# EAGLE design Simon_Says_Jump_MAIN (EAGLE 6.5.0)
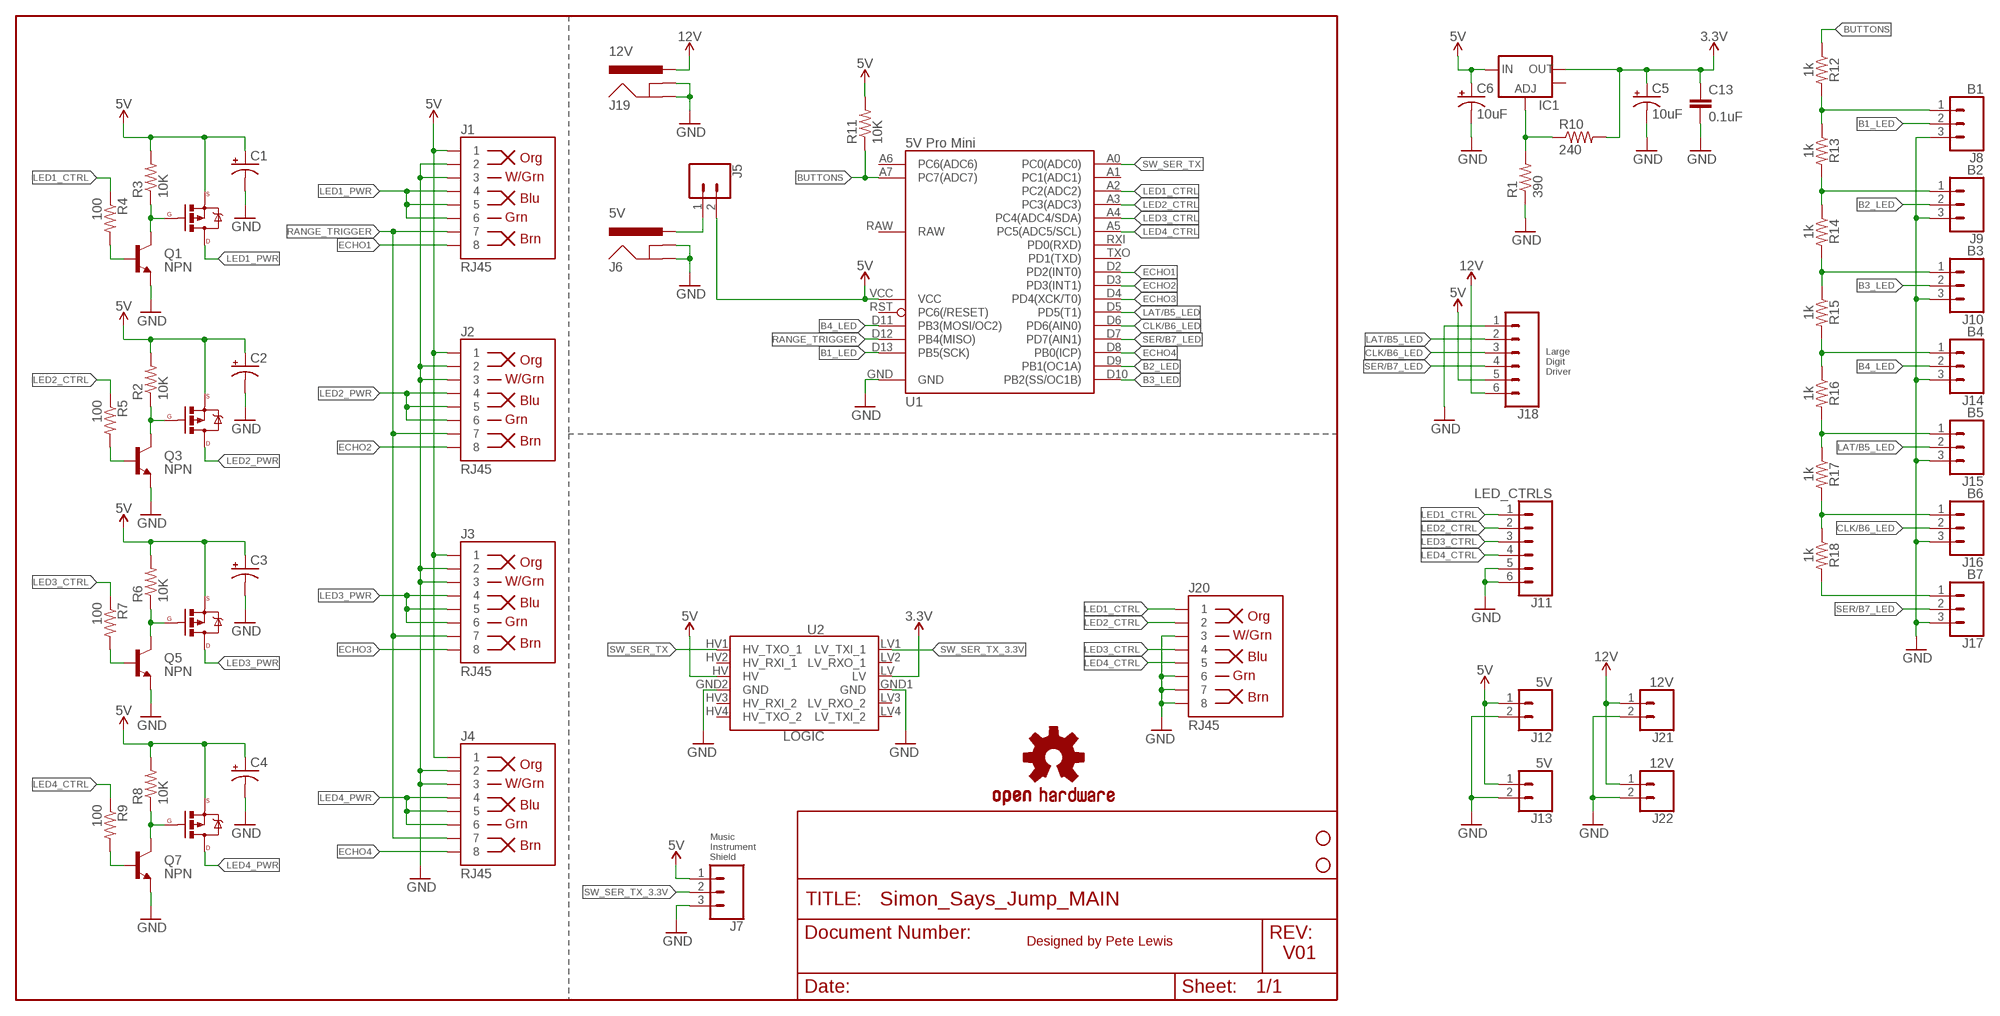
[diagram p0: schematic, sheet 1]

## Parts
C1  CAP_POLCPOL-RADIAL-10UF-25V-KIT  [CPOL-RADIAL-10UF-25V-KIT]
C2  CAP_POLCPOL-RADIAL-10UF-25V-KIT  [CPOL-RADIAL-10UF-25V-KIT]
C3  CAP_POLCPOL-RADIAL-10UF-25V-KIT  [CPOL-RADIAL-10UF-25V-KIT]
C4  CAP_POLCPOL-RADIAL-10UF-25V-KIT  [CPOL-RADIAL-10UF-25V-KIT]
C5  10uF  CAP_POL1206  [EIA3216]
C6  10uF  CAP_POL1206  [EIA3216]
C13  0.1uF  CAP0603-CAP  [0603-CAP]
IC1  V_REG_LM1117SOT223  [SOT223]
J1  RJ45  RJ45-8  [RJ45-8]
J2  RJ45  RJ45-8  [RJ45-8]
J3  RJ45  RJ45-8  [RJ45-8]
J4  RJ45  RJ45-8  [RJ45-8]
J5  CONN_02PTH3  [1X02_LONGPADS]
J6  5V  POWER_JACKPTH_LOCK  [POWER_JACK_PTH_LOCK]
J7  CONN_03LONGPADS  [1X03_LONGPADS]
J8  B1  CONN_03LONGPADS  [1X03_LONGPADS]
J9  B2  CONN_03LONGPADS  [1X03_LONGPADS]
J10  B3  CONN_03LONGPADS  [1X03_LONGPADS]
J11  LED_CTRLS  CONN_06LONGPADS  [1X06_LONGPADS]
J12  5V  CONN_02PTH3  [1X02_LONGPADS]
J13  5V  CONN_02PTH3  [1X02_LONGPADS]
J14  B4  CONN_03LONGPADS  [1X03_LONGPADS]
J15  B5  CONN_03LONGPADS  [1X03_LONGPADS]
J16  B6  CONN_03LONGPADS  [1X03_LONGPADS]
J17  B7  CONN_03LONGPADS  [1X03_LONGPADS]
J18  CONN_06LONGPADS  [1X06_LONGPADS]
J19  12V  POWER_JACKPTH_LOCK  [POWER_JACK_PTH_LOCK]
J20  RJ45  RJ45-8  [RJ45-8]
J21  12V  CONN_02PTH3  [1X02_LONGPADS]
J22  12V  CONN_02PTH3  [1X02_LONGPADS]
JP1  STAND-OFFTIGHTER  [STAND-OFF-TIGHTER]
JP7  STAND-OFFTIGHTER  [STAND-OFF-TIGHTER]
LOGO1  OSHW-LOGOL  [OSHW-LOGO-L]
Q1  NPN  TRANSISTOR_NPNSOT23  [SOT23]
Q2  P-Channel MOSFET  MOSFET-PCHANNELPTH  [TO220V]
Q3  NPN  TRANSISTOR_NPNSOT23  [SOT23]
Q4  P-Channel MOSFET  MOSFET-PCHANNELPTH  [TO220V]
Q5  NPN  TRANSISTOR_NPNSOT23  [SOT23]
Q6  P-Channel MOSFET  MOSFET-PCHANNELPTH  [TO220V]
Q7  NPN  TRANSISTOR_NPNSOT23  [SOT23]
Q8  P-Channel MOSFET  MOSFET-PCHANNELPTH  [TO220V]
R1  390  RESISTOR0603-RES  [0603-RES]
R2  10K  RESISTOR0603-RES  [0603-RES]
R3  10K  RESISTOR0603-RES  [0603-RES]
R4  100  RESISTOR0603-RES  [0603-RES]
R5  100  RESISTOR0603-RES  [0603-RES]
R6  10K  RESISTOR0603-RES  [0603-RES]
R7  100  RESISTOR0603-RES  [0603-RES]
R8  10K  RESISTOR0603-RES  [0603-RES]
R9  100  RESISTOR0603-RES  [0603-RES]
R10  240  RESISTOR0603-RES  [0603-RES]
R11  10K  RESISTOR0603-RES  [0603-RES]
R12  1k  1KOHM-0603-1/10W-1%  [0603]
R13  1k  1KOHM-0603-1/10W-1%  [0603]
R14  1k  1KOHM-0603-1/10W-1%  [0603]
R15  1k  1KOHM-0603-1/10W-1%  [0603]
R16  1k  1KOHM-0603-1/10W-1%  [0603]
R17  1k  1KOHM-0603-1/10W-1%  [0603]
R18  1k  1KOHM-0603-1/10W-1%  [0603]
U1  5V Pro Mini  ARDUINO_PRO_MINI-V13-DIP  [ARDUINO_PRO_MINI-V13_DIP]
U2  LOGIC  SPARKFUN_LOGIC_LEVEL_CONVERTER  [SPARKFUN_LOGIC_LEVEL_CONVERTER]

## Nets
3.3V: C5.A(+) C13.1 IC1.2(OUT) R10.2 U2.LV
5V: C1.1(+) C2.1(+) C3.1(+) C4.1(+) C6.A(+) IC1.3(IN) J1.1 J2.1 J3.1 J4.1 J5.2 J7.1 J12.1 J13.1 J18.5 Q2.3(S) Q4.3(S) Q6.3(S) Q8.3(S) R2.2 R3.2 R6.2 R8.2 R11.2 U1.VCC U2.HV
12V: J18.6 J19.PWR J21.1 J22.1
B1_LED: J8.2 U1.D13(PB5(SCK))
B2_LED: J9.2 U1.D9(PB1(OC1A))
B3_LED: J10.2 U1.D10(PB2(SS/OC1B))
B4_LED: J14.2 U1.D11(PB3(MOSI/OC2))
BUTTONS: R11.1 R12.1 U1.A7(PC7(ADC7))
CLK/B6_LED: J16.2 J18.3 U1.D6(PD6(AIN0))
ECHO1: J1.8 U1.D2(PD2(INT0))
ECHO2: J2.8 U1.D3(PD3(INT1))
ECHO3: J3.8 U1.D4(PD4(XCK/T0))
ECHO4: J4.8 U1.D8(PB0(ICP))
GND: C1.2(-) C2.2(-) C3.2(-) C4.2(-) C5.C(-) C6.C(-) C13.2 J1.2 J1.3 J2.2 J2.3 J3.2 J3.3 J4.2 J4.3 J6.GND J6.GNDBREAK J7.3 J8.3 J9.3 J10.3 J11.5 J11.6 J12.2 J13.2 J14.3 J15.3 J16.3 J17.3 J18.1 J19.GND J19.GNDBREAK J20.3 J20.6 J20.7 J20.8 J21.2 J22.2 Q1.2(E) Q3.2(E) Q5.2(E) Q7.2(E) R1.1 U1.GND U2.GND1(GND) U2.GND2(GND)
LAT/B5_LED: J15.2 J18.2 U1.D5(PD5(T1))
LED1_CTRL [10_mil]: J11.1 J20.1 R4.1 U1.A2(PC2(ADC2))
LED1_PWR [12_mil]: J1.4 J1.5 J1.6 Q2.2(D)
LED2_CTRL [10_mil]: J11.2 J20.2 R5.1 U1.A3(PC3(ADC3))
LED2_PWR: J2.4 J2.5 J2.6 Q4.2(D)
LED3_CTRL [10_mil]: J11.3 J20.4 R7.1 U1.A4(PC4(ADC4/SDA))
LED3_PWR: J3.4 J3.5 J3.6 Q6.2(D)
LED4_CTRL [10_mil]: J11.4 J20.5 R9.1 U1.A5(PC5(ADC5/SCL))
LED4_PWR: J4.4 J4.5 J4.6 Q8.2(D)
N$1 [10_mil]: Q3.3(C) Q4.1(G) R2.1
N$2: J8.1 R12.2 R13.1
N$3: Q1.1(B) R4.2
N$4: J5.1 J6.PWR
N$5 [10_mil]: Q1.3(C) Q2.1(G) R3.1
N$6: J9.1 R13.2 R14.1
N$7: Q3.1(B) R5.2
N$8 [10_mil]: Q5.3(C) Q6.1(G) R6.1
N$9: Q5.1(B) R7.2
N$10 [10_mil]: Q7.3(C) Q8.1(G) R8.1
N$11 [10_mil]: IC1.1(ADJ) R1.2 R10.1
N$12: Q7.1(B) R9.2
N$13: J10.1 R14.2 R15.1
N$14: J14.1 R15.2 R16.1
N$15: J15.1 R16.2 R17.1
N$16: J16.1 R17.2 R18.1
N$17: J17.1 R18.2
RANGE_TRIGGER: J1.7 J2.7 J3.7 J4.7 U1.D12(PB4(MISO))
SER/B7_LED: J17.2 J18.4 U1.D7(PD7(AIN1))
SW_SER_TX: U1.A0(PC0(ADC0)) U2.HV1(HV_TXO_1)
SW_SER_TX_3.3V: J7.2 U2.LV1(LV_TXI_1)
Unconnected: IC1.4(OUT) U1.A1(PC1(ADC1)) U1.A6(PC6(ADC6)) U1.RAW U1.RST(PC6(/RESET)) U1.RXI(PD0(RXD)) U1.TXO(PD1(TXD)) U2.HV2(HV_RXI_1) U2.HV3(HV_RXI_2) U2.HV4(HV_TXO_2) U2.LV2(LV_RXO_1) U2.LV3(LV_RXO_2) U2.LV4(LV_TXI_2)

## Notes on the sheet
- S
- G
- D
- Large
  Digit
  Driver
- S
- G
- D
- S
- G
- D
- S
- G
- D
- Music 
  Instrument 
  Shield
- Designed by Pete Lewis
- V01

## Library data of the parts
C1-C4 = Testing:CAP_POL: Capacitor Polarized These are standard SMD and PTH capacitors. Normally 10uF, 47uF, and 100uF in electrolytic and tantalum varieties. Always verify the external diameter of the through hole cap, it varies with capacity, voltage, and manufacturer. The EIA devices should be standard.
C5 C6 = SparkFun:CAP_POL: Capacitor Polarized These are standard SMD and PTH capacitors. Normally 10uF, 47uF, and 100uF in electrolytic and tantalum varieties. Always verify the external diameter of the through hole cap, it varies with capacity, voltage, and manufacturer. The EIA devices should be standard.
C13 = SparkFun:CAP: Capacitor Standard 0603 ceramic capacitor, and 0.1" leaded capacitor.
IC1 = SparkFun:V_REG_LM1117: Voltage Regulator LM1117 Standard adjustable voltage regulator but in SMD form. Spark Fun Electronics SKU : COM-00595
J1-J4 J20 = SparkFun-Connectors:RJ45-8: RJ45 Jack - 8 pin Simple RJ45, 8-pin connection. Commonly used for Cat5, Cat5e, and Cat6 Ethernet cables. Here is the connector we sell at SparkFun: RJ45 8-Pin Connector <https://www.sparkfun.com/products/643> (PRT-00643) Datasheet <https://cdn.sparkfun.com/datasheets/Prototyping/04908.pdf> It is used on this SparkFun product: SparkFun RJ45 Breakout <https://www.sparkfun.com/products/716> (BOB-00716) Note, you may also be interested in the "MAGJACK" version of this. It is basically a RJ45 connector, but also has some status LEDs built into the connector housing. You can check that out in this library at the device named "MAGJACK.dev" and see these products online: RJ45 Ethernet MagJack-Compatible <https://www.sparkfun.com/products/8534> (PRT-08534) SparkFun RJ45 MagJack Breakout <https://www.sparkfun.com/products/13021> (BOB-13021); PROD_ID: CONN-08506; SF_ID: PRT-00643
J5 J12 J13 J21 J22 = SparkFun-Connectors:CONN_02: Multi connection point. Often used as Generic Header-pin footprint for 0.1 inch spaced/style header connections On any of the 0.1 inch spaced packages, you can populate with these: Break Away Headers - Straight <https://www.sparkfun.com/products/116> (PRT-00116) Break Away Male Headers - Right Angle <https://www.sparkfun.com/products/553> (PRT-00553) Female Headers <https://www.sparkfun.com/products/115> (PRT-00115) Break Away Headers - Machine Pin <https://www.sparkfun.com/products/117> (PRT-00117) Break Away Female Headers - Swiss Machine Pin <https://www.sparkfun.com/products/743> (PRT-00743) For SCREWTERMINALS and SPRING TERMINALS visit here: Screw Terimnals on SparkFun.com <https://www.sparkfun.com/search/results?term=Screw+Terminals> (5mm/3.5mm/2.54mm spacing) This device is also useful as a general connection point to wire up your design to another part of your project. Our various solder wires solder well into these plated through hole pads. Hook-Up Wire - Assortment (Stranded, 22 AWG) <https://www.sparkfun.com/products/11375> (PRT-11375) Hook-Up Wire - Assortment (Solid Core, 22 AWG) <https://www.sparkfun.com/products/11367> (PRT-11367) View the entire wire category on our website here <https://www.sparkfun.com/categories/141> Special notes: Molex polarized connector foot print use with: PRT-08233 with associated crimp pins and housings. 2.54_SCREWTERM for use with PRT-10571. 3.5mm Screw Terminal footprints for PRT-08084 5mm Screw Terminal footprints for use with PRT-08432
J6 J19 = SparkFun:POWER_JACK: Power Jack This is the standard 5.5mm barrel jack for power. The PTH is the most common, proven, reliable, footprint. All others are experimental. The Slot footprint only works if the mill layer is transmitted to the PCB fab house so be warned. Spark Fun Electronics SKU : PRT-00119. Mating wall wart : TOL-00298 (and others)
J7-J10 J14-J17 = SparkFun-Connectors:CONN_03: Multi connection point. Often used as Generic Header-pin footprint for 0.1 inch spaced/style header connections On any of the 0.1 inch spaced packages, you can populate with these: Break Away Headers - Straight <https://www.sparkfun.com/products/116> (PRT-00116) Break Away Male Headers - Right Angle <https://www.sparkfun.com/products/553> (PRT-00553) Female Headers <https://www.sparkfun.com/products/115> (PRT-00115) Break Away Headers - Machine Pin <https://www.sparkfun.com/products/117> (PRT-00117) Break Away Female Headers - Swiss Machine Pin <https://www.sparkfun.com/products/743> (PRT-00743) Stackable Header - 3 Pin (Female, 0.1") <https://www.sparkfun.com/products/13875> (PRT-13875) For SCREWTERMINALS and SPRING TERMINALS visit here: Screw Terimnals on SparkFun.com <https://www.sparkfun.com/search/results?term=Screw+Terminals> (5mm/3.5mm/2.54mm spacing) This device is also useful as a general connection point to wire up your design to another part of your project. Our various solder wires solder well into these plated through hole pads. Hook-Up Wire - Assortment (Stranded, 22 AWG) <https://www.sparkfun.com/products/11375> (PRT-11375) Hook-Up Wire - Assortment (Solid Core, 22 AWG) <https://www.sparkfun.com/products/11367> (PRT-11367) View the entire wire category on our website here <https://www.sparkfun.com/categories/141> Special notes: Molex polarized connector foot print use with SKU : PRT-08232 with associated crimp pins and housings.
J11 J18 = SparkFun-Connectors:CONN_06: Multi connection point. Often used as Generic Header-pin footprint for 0.1 inch spaced/style header connections On any of the 0.1 inch spaced packages, you can populate with these: Break Away Headers - Straight <https://www.sparkfun.com/products/116> (PRT-00116) Break Away Male Headers - Right Angle <https://www.sparkfun.com/products/553> (PRT-00553) Female Headers <https://www.sparkfun.com/products/115> (PRT-00115) Break Away Headers - Machine Pin <https://www.sparkfun.com/products/117> (PRT-00117) Break Away Female Headers - Swiss Machine Pin <https://www.sparkfun.com/products/743> (PRT-00743) Arduino Stackable Header - 6 Pin <https://www.sparkfun.com/products/9280> (PRT-09280) For SCREWTERMINALS and SPRING TERMINALS visit here: Screw Terimnals on SparkFun.com <https://www.sparkfun.com/search/results?term=Screw+Terminals> (5mm/3.5mm/2.54mm spacing) This device is also useful as a general connection point to wire up your design to another part of your project. Our various solder wires solder well into these plated through hole pads. Hook-Up Wire - Assortment (Stranded, 22 AWG) <https://www.sparkfun.com/products/11375> (PRT-11375) Hook-Up Wire - Assortment (Solid Core, 22 AWG) <https://www.sparkfun.com/products/11367> (PRT-11367) View the entire wire category on our website here <https://www.sparkfun.com/categories/141> Special notes: Molex polarized connector foot print use with SKU : PRT-08231 with associated crimp pins and housings. 1MM SMD Version SKU: PRT-10208 NOTES ON THE VARIANTS LOCK and LOCK_LONGPADS... This footprint was designed to help hold the alignment of a through-hole component (i.e. 6-pin header) while soldering it into place. You may notice that each hole has been shifted either up or down by 0.005 of an inch from it's more standard position (which is a perfectly straight line). This slight alteration caused the pins (the squares in the middle) to touch the edges of the holes. Because they are alternating, it causes a "brace" to hold the component in place. 0.005 has proven to be the perfect amount of "off-center" position when using our standard breakaway headers. Although looks a little odd when you look at the bare footprint, once you have a header in there, the alteration is very hard to notice. Also,if you push a header all the way into place, it is covered up entirely on the bottom side.
JP1 JP7 = Testing:STAND-OFF: Stand Off This is the mechanical footprint for a #4 phillips button head screw. Use the keepout ring to avoid running the screw head into surrounding components. SKU : PRT-00447
LOGO1 = SparkFun-Aesthetics:OSHW-LOGO: Open-Source Hardware (OSHW) Logo This logo indicates the piece of hardware it is found on incorporates a OSHW license and/or adheres to the definition of open source hardware found here: http://freedomdefined.org/OSHW
Q1 Q3 Q5 Q7 = SparkFun:TRANSISTOR_NPN: Transistor NPN BJT configuration in SOT23 package. MMBT2222 is the common NPN we use. Double check BCE configuration again layout.
Q2 Q4 Q6 Q8 = Testing:MOSFET-PCHANNEL
R1-R11 = SparkFun:RESISTOR: Resistor Basic schematic elements and footprints for 0603, 1206, and PTH resistors.
R12-R18 = SparkFun-Resistors:1KOHM: 1kΩ resistor A resistor is a passive two-terminal electrical component that implements electrical resistance as a circuit element. Resistors act to reduce current flow, and, at the same time, act to lower voltage levels within circuits. - Wikipedia; PROD_ID: RES-07856
U1 = Testing:ARDUINO_PRO_MINI-V13-DIP
U2 = SparkFun-Boards:SPARKFUN_LOGIC_LEVEL_CONVERTER: SparkFun Logic Level Converter -Bi-Directional This is the mechnical outline for the 3.3V - 5V bi directional logic level converter. SparkFun Products: SparkFun Logic Level Converter - Bi-Directional <https://www.sparkfun.com/products/12009>

## Net classes
1 8_mil: width 0.203 mm
2 10_mil: width 0.254 mm
3 12_mil: width 0.305 mm
4 15_mil: width 0.381 mm
5 20_mil: width 0.508 mm
6 25_mil: width 0.635 mm
7 30_mil: width 0.762 mm

## Board
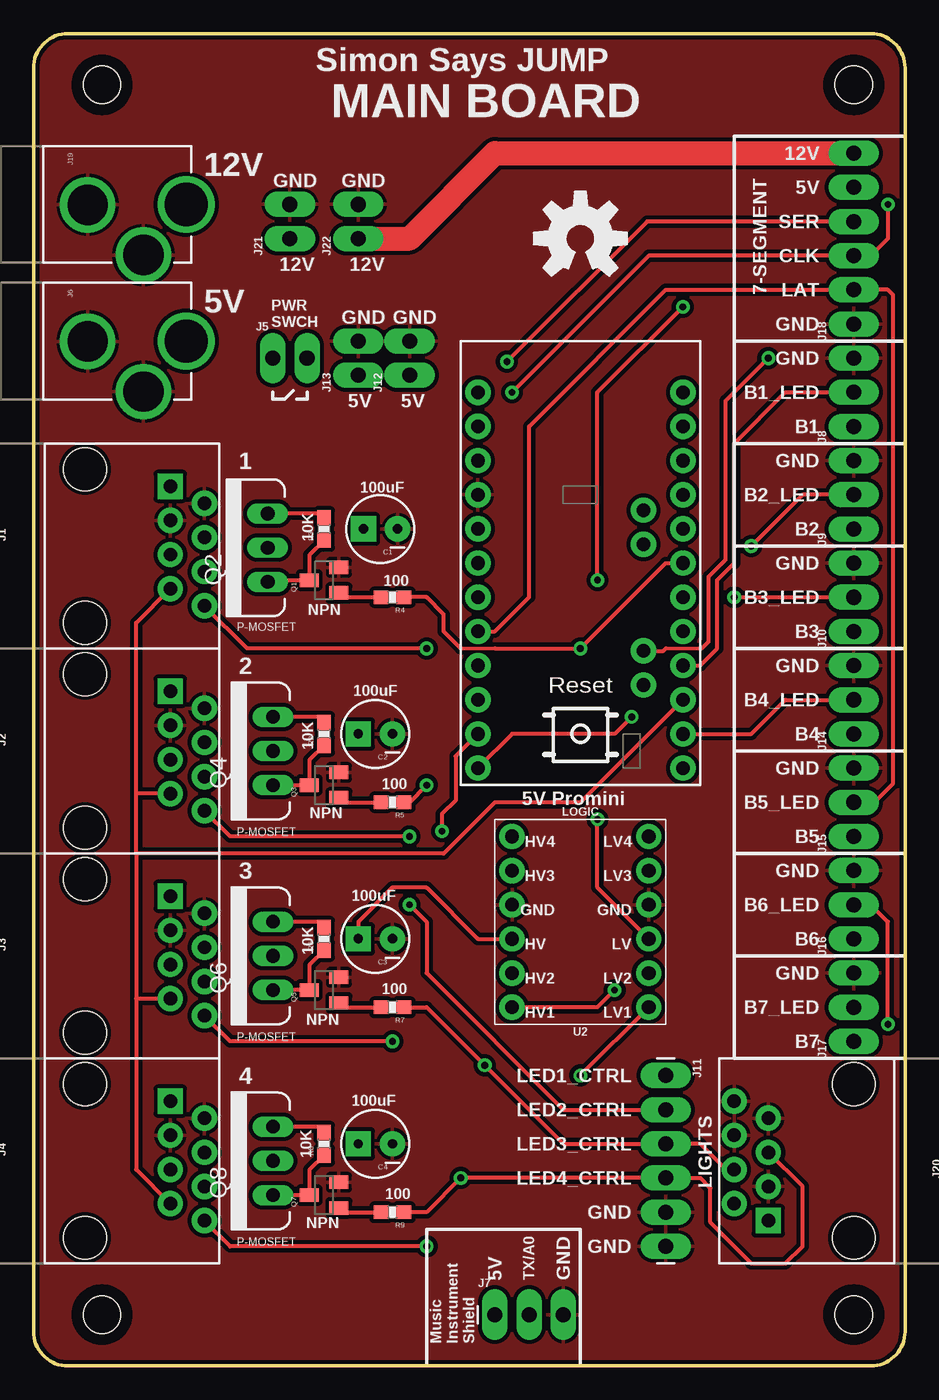
[diagram p1: board, top side]
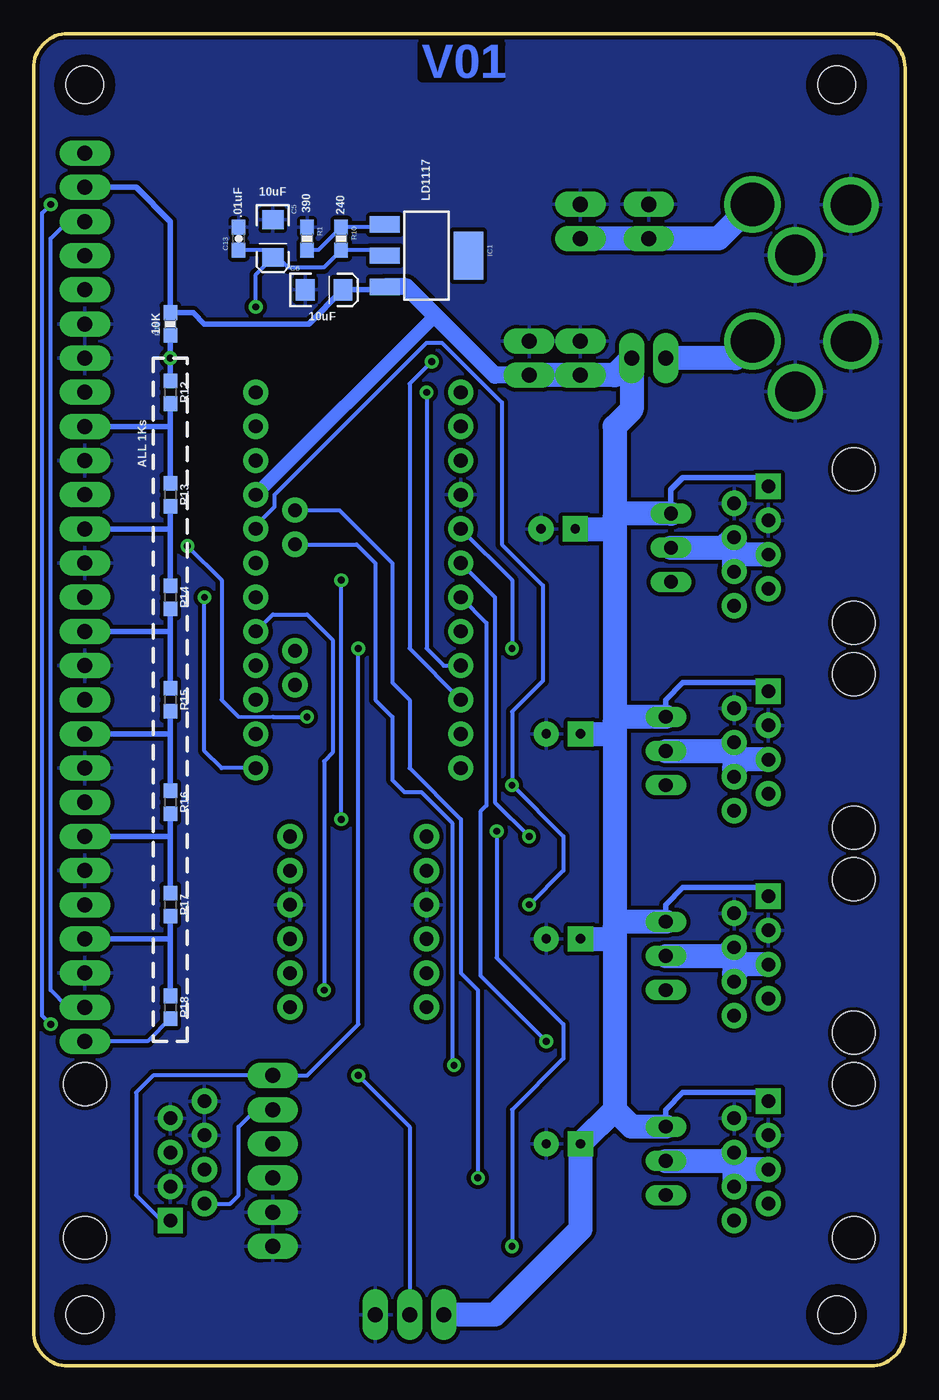
[diagram p2: board, bottom side, seen from below]

Size 64.77 x 99.06 mm. Coordinates in mm from the lower left corner, seen from the top.
Outline: 62.23,0 2.54,0 arc-90 0,2.54 0,96.52 arc-90 2.54,99.06 62.23,99.06 arc-90 64.77,96.52 64.77,2.54 arc-90 62.23,0
Copper layers (1*16): Top 0.035mm / dielectric 1.5mm / Bottom 0.035mm
Design rules "SparkFun-2-layer-STANDARD *": minimum track width 8mil, minimum drill 20mil, track to track 10mil, track to pad 8mil, pad to pad 8mil, via to via 10mil, smd to smd 8mil, copper to edge 8mil, drill to drill 8mil, minimum pad ring 10mil, minimum via ring 10mil, stop-mask expansion 4mil, vias tented up to drill 25mil, thermal gap 10mil

### Footprints (pad centres in the part's own frame; a part is rotated, then mirrored left to right if it is on the bottom)
CPOL-RADIAL-10UF-25V-KIT = drill 0.7 pad 1.88 square: 1 1.27,0 | drill 0.7 pad 1.88: 2 -1.27,0
EIA3216 = smd 1.4 x 1.6: A 1.4,0; C -1.4,0
0603-CAP = smd 1.1 x 1: 1 -0.85,0; 2 0.85,0
SOT223 = smd 1.219 x 2.235: 1 -2.311,-3.099; 2 0,-3.099; 3 2.311,-3.099 | smd 3.6 x 2.2: 4 0,3.099
RJ45-8 = drill 1 pad 1.88 square: 1 -4.445,6.35 | drill 1 pad 1.88: 2 -3.175,8.89; 3 -1.905,6.35; 4 -0.635,8.89; 5 0.635,6.35; 6 1.905,8.89; 7 3.175,6.35; 8 4.445,8.89 | hole 3.2: -5.715,0; 5.715,0
1X02_LONGPADS = drill 1.118 pad 1.88 long: 1 0,0; 2 2.54,0
POWER_JACK_PTH_LOCK = drill 2.997 pad 4.115: GND 0.025,6.557; GNDBREAK 3.762,10.7 | drill 3.2 pad 4.115: PWR 0,13.878
1X03_LONGPADS = drill 1.118 pad 1.88 long: 1 0,0; 2 2.54,0; 3 5.08,0
1X06_LONGPADS = drill 1.118 pad 1.88 long: 1 0,0; 2 2.54,0; 3 5.08,0; 4 7.62,0; 5 10.16,0; 6 12.7,0
STAND-OFF-TIGHTER = hole 2.794: 0,0
SOT23 = smd 1 x 1.4: 1 -0.95,-1.1; 2 0.95,-1.1; 3 0,1.1
TO220V = drill 1.016 long: 1 -2.54,0; 2 0,0; 3 2.54,0
0603-RES = smd 1.1 x 1: 1 -0.85,0; 2 0.85,0
0603 = smd 1.1 x 1: 1 -0.85,0; 2 0.85,0
ARDUINO_PRO_MINI-V13_DIP = drill 1.016 pad 1.88: A0 16.51,11.43; A1 16.51,13.97; A2 16.51,16.51; A3 16.51,19.05; A4 13.589,17.907; A5 13.589,20.447; A6 13.589,7.442; A7 13.589,9.982; D2 1.27,19.05; D3 1.27,16.51; D4 1.27,13.97; D5 1.27,11.43; D6 1.27,8.89; D7 1.27,6.35; D8 1.27,3.81; D9 1.27,1.27; D10 16.51,1.27; D11 16.51,3.81; D12 16.51,6.35; D13 16.51,8.89; GND 1.27,21.59; GND2 16.51,26.67; RAW 16.51,29.21; RST 1.27,24.13; RST2 16.51,24.13; RXI 1.27,26.67; TXO 1.27,29.21; VCC 16.51,21.59
SPARKFUN_LOGIC_LEVEL_CONVERTER = drill 1.016 pad 1.88: GND1 -5.08,-1.27; GND2 5.08,-1.27; HV 5.08,1.27; HV1 5.08,6.35; HV2 5.08,3.81; HV3 5.08,-3.81; HV4 5.08,-6.35; LV -5.08,1.27; LV1 -5.08,6.35; LV2 -5.08,3.81; LV3 -5.08,-3.81; LV4 -5.08,-6.35

### Placement (x,y rotation side)
C1  25.78,62.23 180 top
C2  25.4,46.99 180 top
C3  25.4,31.75 180 top
C4  25.4,16.51 180 top
C5  46.99,83.82 270 bottom
C6  43.18,80.01 0 bottom
C13  49.53,83.82 90 bottom
IC1  35.56,82.55 270 bottom
J1  3.81,60.96 270 top
J2  3.81,45.72 270 top
J3  3.81,30.48 270 top
J4  3.81,15.24 270 top
J5  17.78,74.93 0 top
J6  -2.54,76.2 270 top
J7  34.29,3.81 0 top
J8  60.96,69.85 90 top
J9  60.96,62.23 90 top
J10  60.96,54.61 90 top
J11  46.99,21.59 270 top
J12  27.94,73.66 90 top
J13  24.13,73.66 90 top
J14  60.96,46.99 90 top
J15  60.96,39.37 90 top
J16  60.96,31.75 90 top
J17  60.96,24.13 90 top
J18  60.96,77.47 90 top
J19  -2.54,86.36 270 top
J20  60.96,15.24 90 top
J21  19.05,83.82 90 top
J22  24.13,83.82 90 top
JP1  5.08,95.25 0 top
JP2  STAND-OFFTIGHTER  [STAND-OFF-TIGHTER]  60.96,95.25 0 top
JP3  STAND-OFFTIGHTER  [STAND-OFF-TIGHTER]  60.96,3.81 0 top
JP7  5.08,3.81 0 top
LOGO1  40.64,83.82 0 top
Q1  21.59,58.42 90 top
Q2  17.4,60.83 90 top
Q3  21.59,43.18 90 top
Q4  17.78,45.72 90 top
Q5  21.59,27.94 90 top
Q6  17.78,30.48 90 top
Q7  21.59,12.7 90 top
Q8  17.78,15.24 90 top
R1  44.45,83.82 270 bottom
R2  21.59,46.99 90 top
R3  21.59,62.23 90 top
R4  26.67,57.15 180 top
R5  26.67,41.91 180 top
R6  21.59,31.75 90 top
R7  26.67,26.67 180 top
R8  21.59,16.51 90 top
R9  26.67,11.43 180 top
R10  41.91,83.82 270 bottom
R11  54.61,77.47 90 bottom
R12  54.61,72.39 270 bottom
R13  54.61,64.77 270 bottom
R14  54.61,57.15 270 bottom
R15  54.61,49.53 270 bottom
R16  54.61,41.91 270 bottom
R17  54.61,34.29 270 bottom
R18  54.61,26.67 270 bottom
U1  31.75,43.18 0 top
U2  40.64,33.02 180 top

### Tracks (layer width: path | path; a pad name or v marks a point on that pad's centre or on a via)
3.3V  (via drill 0.51)
  Top 0.305: U2.LV 41.91,35.56 v41.91,40.64 | v41.91,58.42 41.91,72.39 v48.26,78.74
  Bottom 0.305: IC1.2 39.08,82.97 R10.2 43.22,81.66 45.85,81.66 46.61,82.42 C5.A | C5.A 47.54,82.97 C13.1 | v41.91,40.64 v41.91,58.42 | v48.26,78.74 48.26,81.15 C5.A
5V
  Top 0.305: R8.2 21.17,17.78 Q8.3 | R6.2 21.17,33.02 Q6.3 | R2.2 21.17,48.26 Q4.3 | R3.2 21.3,63.37 Q2.3 | U2.HV 33.02,31.75 29.21,35.56 26.67,35.56 24.13,33.02 C3.1
  Bottom 0.406: Q2.3 17.4,65.15 16.51,66.04 10.79,66.04 J1.1 | Q4.3 17.78,49.53 16.51,50.8 10.79,50.8 J2.1 | Q6.3 17.78,34.29 16.51,35.56 10.79,35.56 J3.1 | Q8.3 17.78,19.05 16.51,20.32 10.79,20.32 J4.1 | IC1.3 38.89,80.01 C6.A 44.32,77.47 52.07,77.47 52.92,78.32 R11.2 54.61,85.09 57.15,87.63 J18.5
  Bottom 1.016: U1.VCC 34.92,78.11
  Bottom 1.27: J12.1 30.48,73.66 34.92,78.11 37.06,80.24 IC1.3
  Bottom 1.778: J12.1 J13.1 21.59,73.66 J5.2 20.32,71.12 21.59,69.85 R3.2 | R3.2 21.59,62.23 | 21.59,62.23 R2.2 | R2.2 21.59,46.99 | 21.59,46.99 R6.2 | R6.2 21.59,31.75 | 21.59,31.75 21.59,19.05 | Q8.3 20.32,17.78 21.59,19.05 | 21.59,19.05 C4.1 24.13,10.16 30.48,3.81 J7.1 | Q6.3 21.17,33.02 R6.2 | C3.1 21.59,31.75 | Q4.3 21.17,48.26 R2.2 | C2.1 21.59,46.99 | Q2.3 21.3,63.37 R3.2 | C1.1 21.59,62.23
12V
  Top 1.778: J22.1 27.94,83.82 34.29,90.17 J18.6
  Bottom 1.778: J22.1 J21.1 13.88,83.82 J19.PWR
B1_LED
  Top 0.305: U1.D13 49.53,52.07 50.8,53.34 50.8,58.42 52.07,59.69 52.07,68.58 55.88,72.39 J8.2
B2_LED  (via drill 0.51)
  Top 0.305: J9.2 57.15,64.77 v53.34,60.96 | v44.45,48.26 43.18,46.99 35.56,46.99 U1.D9
  Bottom 0.254: 49.53,48.26 46.99,48.26
  Bottom 0.305: v53.34,60.96 50.8,58.42 50.8,49.53 49.53,48.26 | 46.99,48.26 v44.45,48.26
B3_LED  (via drill 0.51)
  Top 0.305: v52.07,57.15 J10.2
  Bottom 0.305: U1.D10 50.8,44.45 52.07,45.72 v52.07,57.15
B4_LED
  Top 0.305: U1.D11 53.34,46.99 55.88,49.53 J14.2
BUTTONS  (via drill 0.51)
  Top 0.254: 46.99,53.34 49.66,53.34
  Top 0.305: U1.A7 46.81,53.16 46.99,53.34 | 49.66,53.34 50.16,53.85 50.16,58.67 51.44,59.94 51.44,71.75 v54.61,74.93
  Bottom 0.406: R11.1 v54.61,74.93 R12.1
CLK/B6_LED  (via drill 0.51)
  Top 0.305: v35.56,72.39 45.72,82.55 J18.3 62.23,82.55 63.5,83.82 v63.5,86.36 | v63.5,25.4 63.5,33.02 62.23,34.29 J16.2
  Bottom 0.305: v35.56,72.39 35.56,53.34 34.29,52.07 U1.D6 | v63.5,86.36 64.14,85.72 64.14,26.04 v63.5,25.4
ECHO1  (via drill 0.51)
  Top 0.305: v29.21,53.34 15.88,53.34 J1.8
  Bottom 0.305: U1.D2 29.21,58.42 v29.21,53.34
ECHO2  (via drill 0.51)
  Top 0.305: v27.94,39.37 14.61,39.37 J2.8
  Bottom 0.305: U1.D3 30.48,57.15 30.48,41.91 v27.94,39.37
ECHO3  (via drill 0.51)
  Top 0.305: v26.67,24.13 14.61,24.13 J3.8
  Bottom 0.305: v26.67,24.13 31.56,29.02 31.56,41.21 31.11,41.66 31.11,55.24 U1.D4
ECHO4  (via drill 0.51)
  Top 0.305: U1.D8 31.37,45.34 31.37,42.04 30.35,41.02 v30.35,39.75 | v29.21,8.89 14.61,8.89 J4.8
  Bottom 0.305: v30.35,39.75 30.35,30.35 25.4,25.4 25.4,22.86 29.21,19.05 v29.21,8.89
GND
  pour Bottom (isolate 0.305): 0,99.06 64.77,99.06 64.77,0 0,0
  pour Top (isolate 0.305): 0,99.06 64.77,99.06 64.77,0 0,0
LAT/B5_LED
  Top 0.305: U1.D5 34.29,54.61 36.83,57.15 36.83,69.85 46.99,80.01 J18.2 63.5,80.01 63.88,79.63 63.88,43.31 62.48,41.91 J15.2
LED1_CTRL  (via drill 0.51)
  Top 0.254: 31.75,53.34 34.29,53.34
  Top 0.305: 31.75,53.34 30.48,54.61 30.48,55.88 29.21,57.15 R4.1 | U1.A2 46.99,59.69 v40.64,53.34 34.29,53.34
  Bottom 0.305: J20.1 55.24,10.79 57.15,12.7 57.15,20.32 55.88,21.59 J11.1 44.45,21.59 40.64,25.4 v40.64,53.34
LED1_PWR
  Bottom 1.778: Q2.2 13.46,60.83 J1.4 12.7,60.96 | J1.6 12.7,60.96 | J1.5 12.06,60.33 12.7,60.96
LED2_CTRL  (via drill 0.51)
  Top 0.305: R5.1 27.94,41.91 v29.21,43.18 | v27.94,34.29 29.21,33.02 29.21,29.21 39.37,19.05 J11.2
  Bottom 0.305: J20.2 50.16,12.06 49.53,12.7 49.53,17.78 48.26,19.05 J11.2 | v27.94,34.29 25.4,36.83 25.4,39.37 v29.21,43.18 29.21,48.64 26.92,50.93 26.92,58.04 29.97,61.09 29.97,71.63 34.42,76.07 35.56,76.07 46.86,64.77 46.86,63.88 48.26,62.48 U1.A3
LED2_PWR
  Bottom 1.778: Q4.2 13.34,45.72 J2.4 12.7,44.45 | 12.7,44.45 J2.6 | J2.5 12.06,45.09 12.7,44.45
LED3_CTRL  (via drill 0.51)
  Top 0.305: J20.4 51.44,14.61 49.53,16.51 J11.3 39.37,16.51 v33.53,22.35 29.21,26.67 R7.1
  Bottom 0.305: U1.A4 40.77,61.09 39.37,59.69 39.37,49.53 38.1,48.26 38.1,43.56 37.21,42.67 35.94,42.67 33.66,40.39 33.66,22.48 v33.53,22.35
LED3_PWR
  Bottom 1.778: Q6.2 13.34,30.48 J3.4 12.7,29.21 | 12.7,29.21 J3.6 | J3.5 12.06,29.84 12.7,29.21
LED4_CTRL  (via drill 0.51)
  Top 0.305: J20.5 57.15,13.34 57.15,8.89 55.88,7.62 53.34,7.62 50.29,10.67 50.29,13.21 49.53,13.97 J11.4 v31.75,13.97 29.21,11.43 R9.1
  Bottom 0.305: U1.A5 42.04,63.63 38.1,59.69 38.1,50.8 36.83,49.53 36.83,44.45 33.02,40.64 33.02,29.21 31.75,27.94 v31.75,13.97
LED4_PWR
  Bottom 1.778: Q8.2 13.34,15.24 J4.4 12.7,15.24 | 12.7,15.24 J4.6 | J4.5 12.06,14.61 12.7,15.24
N$1
  Top 0.305: R2.1 20.49,45.04 Q3.3 Q4.1
N$2
  Bottom 0.406: R12.2 54.61,69.85 | 54.61,69.85 R13.1 | J8.1 54.61,69.85
N$3
  Top 0.305: Q1.1 23.01,57.15 R4.2
N$4
  Bottom 1.778: J6.PWR 12.61,74.93 J5.1
N$5
  Top 0.305: R3.1 20.49,60.28 Q1.3 17.53,58.42 Q2.1
N$6
  Bottom 0.406: R13.2 54.61,62.23 | 54.61,62.23 R14.1 | J9.1 54.61,62.23
N$7
  Top 0.305: Q3.1 23.01,41.91 R5.2
N$8
  Top 0.305: R6.1 20.49,29.8 Q5.3 Q6.1
N$9
  Top 0.305: Q5.1 23.01,26.67 R7.2
N$10
  Top 0.305: R8.1 20.49,14.56 Q7.3 Q8.1
N$11
  Bottom 0.305: IC1.1 38.85,84.67 R10.1 43.61,82.97 R1.2
N$12
  Top 0.305: Q7.1 23.01,11.43 R9.2
N$13
  Bottom 0.406: R14.2 54.61,54.61 | 54.61,54.61 R15.1 | J10.1 54.61,54.61
N$14
  Bottom 0.406: R15.2 54.61,46.99 | 54.61,46.99 R16.1 | J14.1 54.61,46.99
N$15
  Bottom 0.406: R16.2 54.61,39.37 | 54.61,39.37 R17.1 | J15.1 54.61,39.37
N$16
  Bottom 0.406: R17.2 54.61,31.75 | 54.61,31.75 R18.1 | J16.1 54.61,31.75
N$17
  Bottom 0.305: R18.2 56.3,24.13 J17.1
RANGE_TRIGGER
  Top 0.305: U1.D12 40.64,41.91 34.29,41.91 30.48,38.1 7.62,38.1 | 7.62,38.1 7.62,42.55 | J1.7 7.62,55.24 7.62,43.18 7.62,42.55 | 7.62,38.1 7.62,27.3 | 7.62,27.3 7.62,14.61 J4.7 | J3.7 7.62,27.3 | J2.7 7.62,42.55
SER/B7_LED  (via drill 0.51)
  Top 0.305: J18.4 45.59,85.09 v35.18,74.68
  Bottom 0.305: U1.D7 36.83,53.34 36.83,73.03 v35.18,74.68 | J17.2 62.23,26.67 63.5,27.94 63.5,83.82 62.23,85.09 J18.4
SW_SER_TX  (via drill 0.51)
  Top 0.305: v43.18,27.94 41.91,26.67 U2.HV1
  Bottom 0.305: U1.A0 46.99,55.88 44.45,55.88 42.55,53.98 42.55,45.59 43.18,44.96 v43.18,27.94
SW_SER_TX_3.3V  (via drill 0.51)
  Top 0.305: U2.LV1 v40.64,21.59
  Bottom 0.305: v40.64,21.59 36.83,17.78 J7.2

### Text on the board
Bottom: V01
tPlace: Simon Says JUMP | MAIN BOARD | 12V | 12V | GND | GND | 5V | SER | CLK | 12V | 12V | 7-SEGMENT | LAT | 5V | PWR / SWCH | GND | GND | GND | GND | B1_LED | 5V | 5V | B1 | 1 | GND | 100uF | B2_LED | B2 | 10K | GND | 100 | NPN | B3_LED | P-MOSFET | B3 | 2 | GND | 100uF | B4_LED | B4 | 10K | 100 | GND | NPN | 5V Promini | B5_LED | P-MOSFET | B5 | 3 | GND | 100uF | B6_LED | B6 | 10K | GND | 100 | B7_LED | NPN | P-MOSFET | B7 | 4 | LED1_CTRL | 100uF | LED2_CTRL | LED3_CTRL | 10K | LED4_CTRL | 100 | LIGHTS | NPN | GND | P-MOSFET | GND | 5V | TX/A0 | GND | Music / Instrument / Shield
bPlace: LD1117 | 10uF | 240 | 390 | .01uF | 10uF | 10K | ALL 1Ks